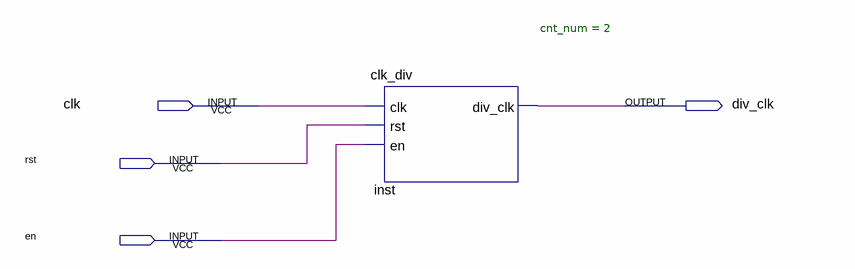
[diagram p0: schematic sheet]
// Quartus schematic test.bdf as structural Verilog: 1 symbols, 4 pins
module test (
  input  clk,
  input  rst,
  input  en,
  output div_clk
);

  clk_div #(.cnt_num(2)) inst (.clk(clk), .rst(rst), .en(en), .div_clk(div_clk));
endmodule
